# EAGLE design LinkMeterHM (EAGLE 5.10)
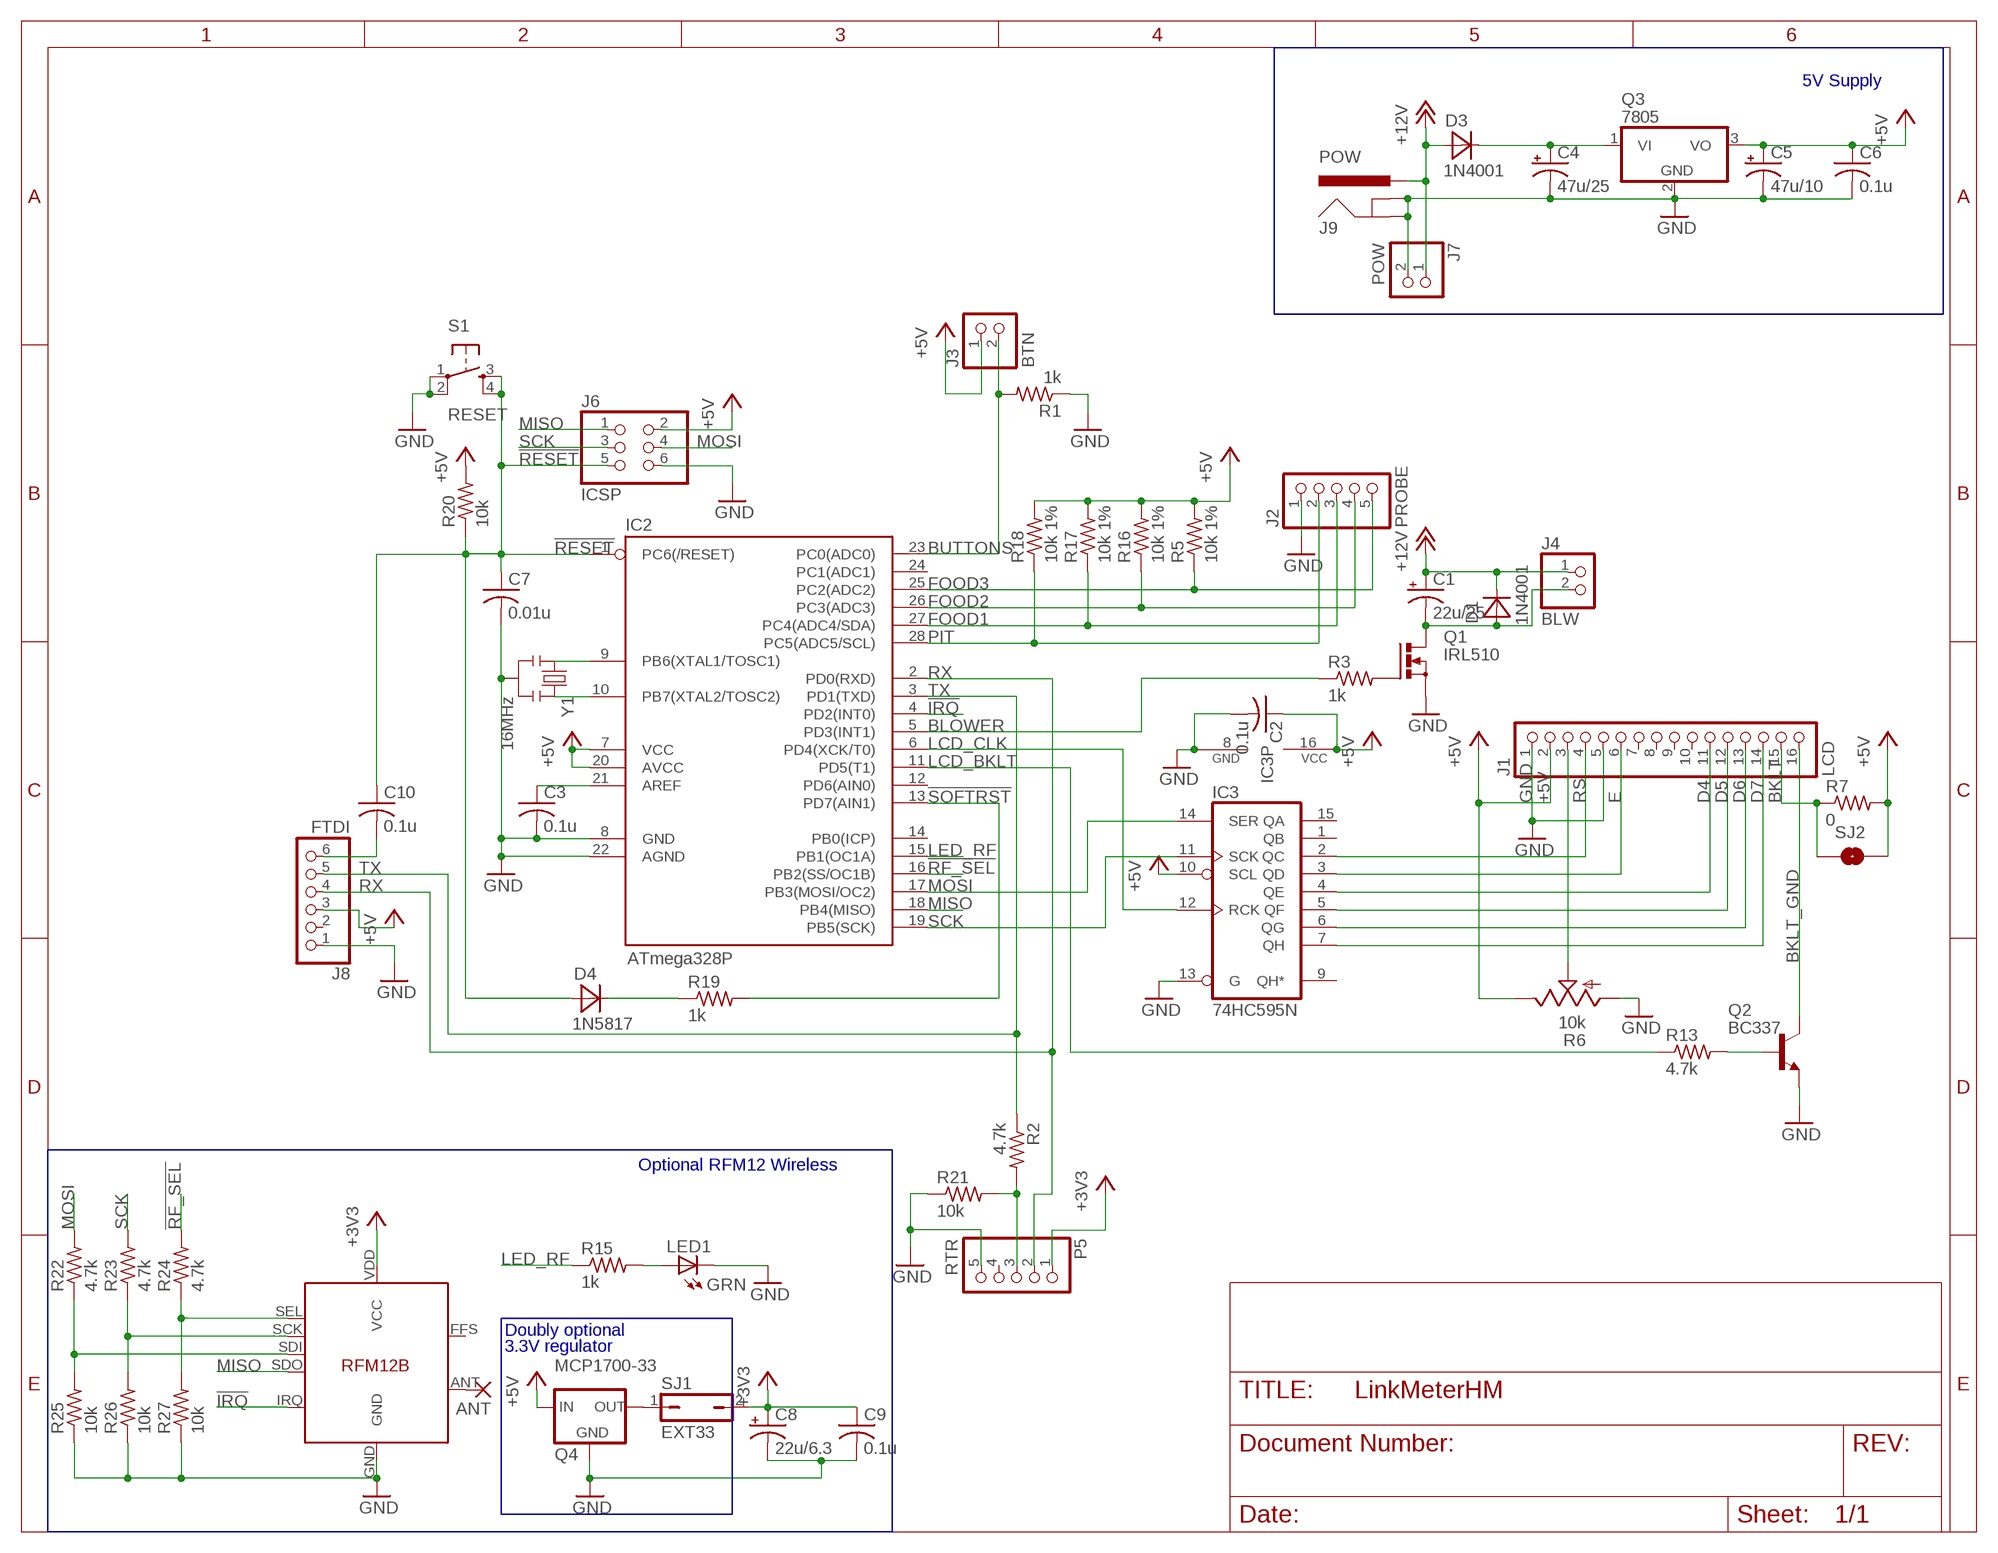
[diagram p0: schematic, sheet 1]

## Parts
ANT  1,6/0,8  [1,6/0,8]
C1  22u/25  CPOL-USE2.5-6  [E2,5-6]
C2  0.1u  C-US025-025X050  [C025-025X050]
C3  0.1u  C-US025-025X050  [C025-025X050]
C4  47u/25  CPOL-USE2.5-6  [E2,5-6]
C5  47u/10  CPOL-USE2.5-6  [E2,5-6]
C6  0.1u  C-US025-025X050  [C025-025X050]
C7  0.01u  C-US025-025X050  [C025-025X050]
C8  22u/6.3  CPOL-USE2.5-6  [E2,5-6]
C9  0.1u  C-US025-025X050  [C025-025X050]
C10  0.1u  C-US025-025X050  [C025-025X050]
D1  1N4001  DIODE-DO41-5  [DO41-5]
D3  1N4001  DIODE-DO41-7  [DO41-7]
D4  1N5817  DIODE-DO41-7  [DO41-7]
IC2  ATmega328P  AVR-MEGA8-PPTH  [DIL28-3]
IC3  74HC595N  74LS595N  [DIL16]
J1  LCD  PINHD-1X16  [1X16]
J2  PROBE  PINHD-1X5  [1X05]
J3  BTN  PINHD-1X2  [1X02]
J4  BLW  PINHD-1X2  [1X02]
J6  ICSP  PINHD-2X3  [2X03]
J7  POW  PINHD-1X2/90  [1X02/90]
J8  FTDI  PINHD-1X6  [1X06]
J9  POW  POWER_JACKPTH  [POWER_JACK_PTH]
LED1  GRN  LED3MM  [LED3MM]
P5  RTR  PINHD-1X5/90  [1X05/90]
Q1  IRL510  PMOSFET_NTO220BV  [TO220BV]
Q2  BC337  [TO92]
Q3  7805  7805TV  [TO220V]
Q4  MCP1700-33  MCP1700TRI  [TO92]
R1  1k  R-US_0204/7  [0204/7]
R2  4.7k  R-US_0204/7  [0204/7]
R3  1k  R-US_0204/7  [0204/7]
R5  10k 1%  R-US_0204/7  [0204/7]
R6  10k  TRIM_US-CT6  [CT6]
R7  0  R-US_0204/7  [0204/7]
R13  4.7k  R-US_0204/7  [0204/7]
R15  1k  R-US_0204/7  [0204/7]
R16  10k 1%  R-US_0204/7  [0204/7]
R17  10k 1%  R-US_0204/7  [0204/7]
R18  10k 1%  R-US_0204/7  [0204/7]
R19  1k  R-US_0204/7  [0204/7]
R20  10k  R-US_0204/7  [0204/7]
R21  10k  R-US_0204/7  [0204/7]
R22  4.7k  R-US_0204/7  [0204/7]
R23  4.7k  R-US_0204/7  [0204/7]
R24  4.7k  R-US_0204/7  [0204/7]
R25  10k  R-US_0204/7  [0204/7]
R26  10k  R-US_0204/7  [0204/7]
R27  10k  R-US_0204/7  [0204/7]
S1  RESET  TAC_SWITCHPTH  [TACTILE-PTH]
SJ1  EXT33  JP1QJP1  [JP1]
SJ2  CLIM  SOLDERJUMPERTRACE  [SJ_2S-TRACE]
U$1  RFM12B  [RFM12B]
Y1  16MHz  RESONATORRESONATOR-PTH  [RESONATOR-PTH]

## Nets
!IRQ: IC2.4(PD2(INT0)) U$1.IRQ
!RESET: C7.1 C10.1 D4.A IC2.1(PC6(/RESET)) J6.5 R20.1 S1.3 S1.4
!RF_SEL: IC2.16(PB2(SS/OC1B)) R24.2
!SOFTRST: IC2.13(PD7(AIN1)) R19.2
+3V3: C8.+ C9.1 P5.1 SJ1.2 U$1.VDD(VCC)
+5V: C2.1 C5.+ C6.1 IC2.7(VCC) IC2.20(AVCC) IC3.10(SCL) IC3.16(VCC) J1.2 J3.1 J6.2 J8.3 Q3.3(VO) Q4.2(IN) R5.2 R6.E R7.2 R16.2 R17.2 R18.2 R20.2 SJ2.2
+12V: C1.+ D1.C D3.A J4.1 J7.1 J9.PWR
BKLT: J1.15 R7.1 SJ2.1
BKLT_GND: J1.16 Q2.3(C)
BLOWER: IC2.5(PD3(INT1)) R3.1
BLW_GND: C1.- D1.A J4.2 Q1.D
BUTTONS: IC2.23(PC0(ADC0)) J3.2 R1.2
D4: IC3.4(QE) J1.11
D5: IC3.5(QF) J1.12
D6: IC3.6(QG) J1.13
D7: IC3.7(QH) J1.14
E: IC3.3(QD) J1.6
FOOD1: IC2.27(PC4(ADC4/SDA)) J2.3 R17.1
FOOD2: IC2.26(PC3(ADC3)) J2.4 R16.1
FOOD3: IC2.25(PC2(ADC2)) J2.5 R5.1
GND: C2.2 C3.2 C4.- C5.- C6.2 C7.2 C8.- C9.2 IC2.8(GND) IC2.22(AGND) IC3.8(GND) IC3.13(G) J1.1 J1.5 J2.1 J6.6 J7.2 J8.1 J9.GND J9.GNDBREAK LED1.K(C) P5.5 Q1.S Q2.1(E) Q3.2(GND) Q4.1(GND) R1.1 R6.A R21.1 R25.1 R26.1 R27.1 S1.1 S1.2 U$1.GND Y1.2
LCD_BKLT: IC2.11(PD5(T1)) R13.1
LCD_CLK: IC2.6(PD4(XCK/T0)) IC3.12(RCK)
LED_RF: IC2.15(PB1(OC1A)) R15.1
MISO: IC2.18(PB4(MISO)) J6.1 U$1.SDO
MOSI: IC2.17(PB3(MOSI/OC2)) IC3.14(SER) J6.4 R22.2
N$1: D4.C R19.1
N$2: Q4.3(OUT) SJ1.1
N$3: J1.3 R6.S
N$4: C10.2 J8.6
N$5: ANT.1(P) U$1.ANT
N$11: Q1.G R3.2
N$13: IC2.10(PB7(XTAL2/TOSC2)) Y1.3
N$16: IC2.9(PB6(XTAL1/TOSC1)) Y1.1
N$17: C3.1 IC2.21(AREF)
N$22: Q2.2(B) R13.2
N$24: LED1.A R15.2
N$26: P5.3 R2.2 R21.2
N$36: R24.1 R27.2 U$1.SEL
N$37: R23.1 R26.2 U$1.SCK
N$38: R22.1 R25.2 U$1.SDI
PIT: IC2.28(PC5(ADC5/SCL)) J2.2 R18.1
RS: IC3.2(QC) J1.4
RX: IC2.2(PD0(RXD)) J8.4 P5.2
SCK: IC2.19(PB5(SCK)) IC3.11(SCK) J6.3 R23.2
TX: IC2.3(PD1(TXD)) J8.5 R2.1
VRM_IN: C4.+ D3.C Q3.1(VI)
Unconnected: IC2.12(PD6(AIN0)) IC2.14(PB0(ICP)) IC2.24(PC1(ADC1)) IC3.1(QB) IC3.9(QH*) IC3.15(QA) J1.7 J1.8 J1.9 J1.10 J8.2 P5.4 U$1.FFS

## Buses
B$1
B$2
B$6

## Notes on the sheet
- 5V Supply
- Optional RFM12 Wireless
- Doubly optional
- 3.3V regulator

## Library data of the parts
ANT = JeeLabs:1,6/0,8: THROUGH-HOLE PAD
C1 C4 C5 C8 = resistor:CPOL-US: POLARIZED CAPACITOR, American symbol
C2 C3 C6 C7 C9 C10 = resistor:C-US: CAPACITOR, American symbol
D1 D3 D4 = Bryan:DIODE-: DO41 diodes with octagon holes and no diode symbol in silk
IC2 = SparkFun:AVR-MEGA8-P: MICROCONTROLLER 8 Kbytes FLASH 1 kbytes SRAM 512 bytes EEPROM USART 4-channel 10 bit ADC 2-channel 8 bit ADC
IC3 = 74xx-us:74*595: 8-bit SHIFT REGISTER, output latch
J1 = pinhead:PINHD-1X16: PIN HEADER
J2 P5 = pinhead:PINHD-1X5: PIN HEADER
J3 J4 J7 = pinhead:PINHD-1X2: PIN HEADER
J6 = pinhead:PINHD-2X3: PIN HEADER
J8 = pinhead:PINHD-1X6: PIN HEADER
J9 = SparkFun:POWER_JACK: Power Jack This is the standard 5.5mm barrel jack for power. The PTH is the most common, proven, reliable, footprint. All others are experimental. The Slot footprint only works if the mill layer is transmitted to the PCB fab house so be warned. Spark Fun Electronics SKU : PRT-00119. Mating wall wart : TOL-00298 (and others)
LED1 = led:LED: LED OSRAM: - CHIPLED LG R971, LG N971, LY N971, LG Q971, LY Q971, LO R971, LY R971 LH N974, LH R974 LS Q976, LO Q976, LY Q976 LO Q996 - Hyper CHIPLED LW Q18S LB Q993, LB Q99A, LB R99A - SideLED LS A670, LO A670, LY A670, LG A670, LP A670 LB A673, LV A673, LT A673, LW A673 LH A674 LY A675 LS A676, LA A676, LO A676, LY A676, LW A676 LS A679, LY A679, LG A679 - Hyper Micro SIDELED® LS Y876, LA Y876, LO Y876, LY Y876 LT Y87S - SmartLED LW L88C, LW L88S LB L89C, LB L89S, LG L890 LS L89K, LO L89K, LY L89K LS L896, LA L896, LO L896, LY L896 - TOPLED LS T670, LO T670, LY T670, LG T670, LP T670 LSG T670, LSP T670, LSY T670, LOP T670, LYG T670 LG T671, LOG T671, LSG T671 LB T673, LV T673, LT T673, LW T673 LH T674 LS T676, LA T676, LO T676, LY T676, LB T676, LH T676, LSB T676, LW T676 LB T67C, LV T67C, LT T67C, LS T67K, LO T67K, LY T67K, LW E67C LS E67B, LA E67B, LO E67B, LY E67B, LB E67C, LV E67C, LT E67C LW T67C LS T679, LY T679, LG T679 LS T770, LO T770, LY T770, LG T770, LP T770 LB T773, LV T773, LT T773, LW T773 LH T774 LS E675, LA E675, LY E675, LS T675 LS T776, LA T776, LO T776, LY T776, LB T776 LHGB T686 LT T68C, LB T68C - Hyper Mini TOPLED® LB M676 - Mini TOPLED Santana® LG M470 LS M47K, LO M47K, LY M47K Source: http://www.osram.convergy.de LUXEON: - LUMILED® LXK2-PW12-R00, LXK2-PW12-S00, LXK2-PW14-U00, LXK2-PW14-V00 LXK2-PM12-R00, LXK2-PM12-S00, LXK2-PM14-U00 LXK2-PE12-Q00, LXK2-PE12-R00, LXK2-PE12-S00, LXK2-PE14-T00, LXK2-PE14-U00 LXK2-PB12-K00, LXK2-PB12-L00, LXK2-PB12-M00, LXK2-PB14-N00, LXK2-PB14-P00, LXK2-PB14-Q00 LXK2-PR12-L00, LXK2-PR12-M00, LXK2-PR14-Q00, LXK2-PR14-R00 LXK2-PD12-Q00, LXK2-PD12-R00, LXK2-PD12-S00 LXK2-PH12-R00, LXK2-PH12-S00 LXK2-PL12-P00, LXK2-PL12-Q00, LXK2-PL12-R00 Source: www.luxeon.com KINGBRIGHT: KA-3528ASYC Source: www.kingbright.com
Q1 = transistor-power:PMOSFET_N: Power MOSFET N-Channel
Q2 = transistor:BC337: NPN TRANSISTOR
Q3 = linear:78*: Positive VOLTAGE REGULATOR Source: http://cache.national.com/ds/LM/LM78L05.pdf http://www.fairchildsemi.com/ds/LM/LM7805.pdf
Q4 = adafruit:MCP1700: VOLTAGE REGULATOR
R1-R3 R5 R7 R13 R15-R27 = resistor:R-US_: RESISTOR, American symbol
R6 = pot:TRIM_US-: POTENTIOMETER
S1 = SparkFun:TAC_SWITCH: Momentary Switch Button commonly used for reset or general input. Spark Fun Electronics SKU : COM-00097
SJ1 = Bryan:JP1Q
SJ2 = SparkFun:SOLDERJUMPER: Solder Jumper Standard SMD solder jumper. Used to automate production. Two varients : Normally Open and Normally Closed are the same, but have different paste layers. NC will have a large amount of paste and should jumper during reflow.
U$1 = JeeLabs:RFM12B
Y1 = Bryan:RESONATOR

## Board
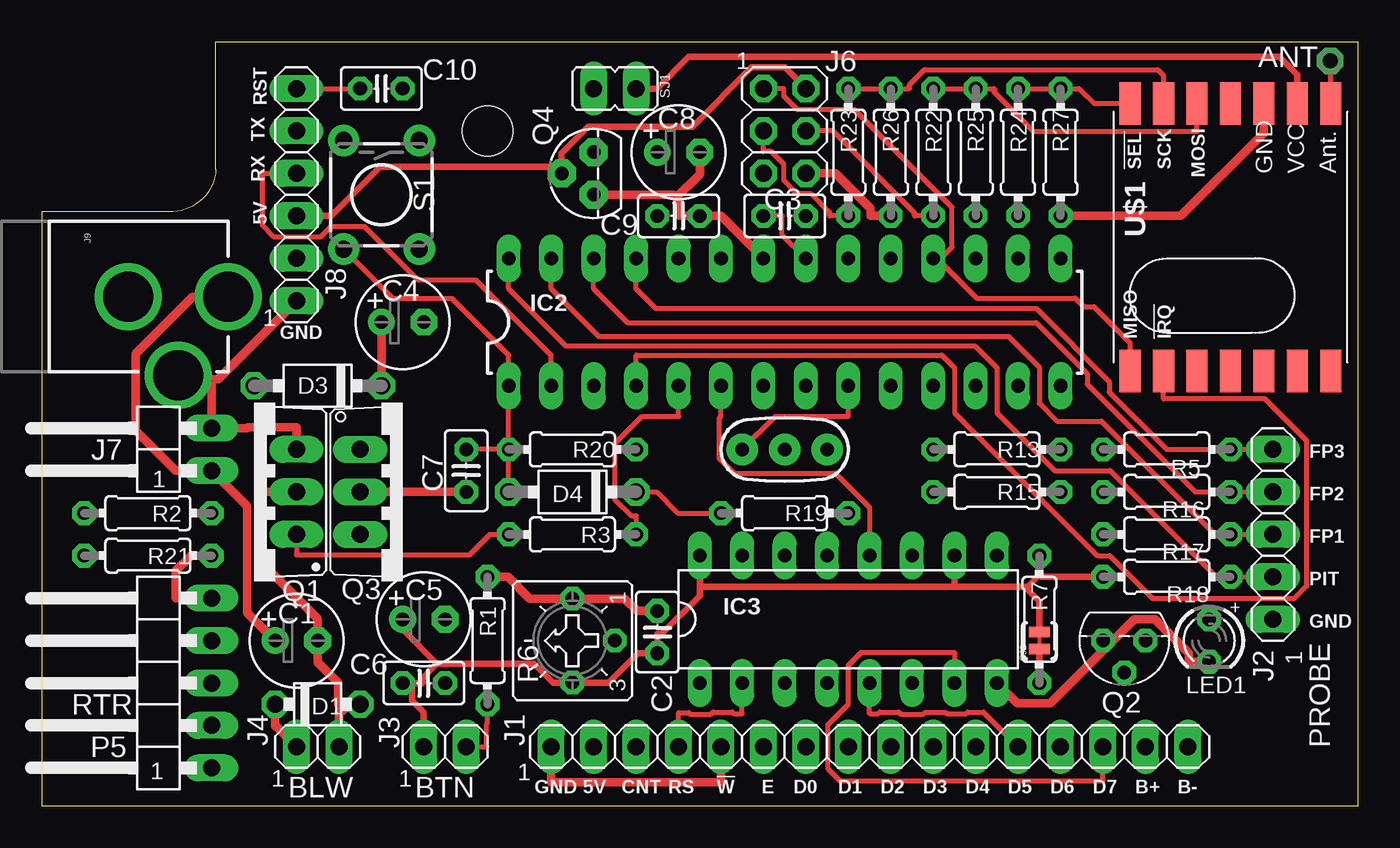
[diagram p1: board, top side]
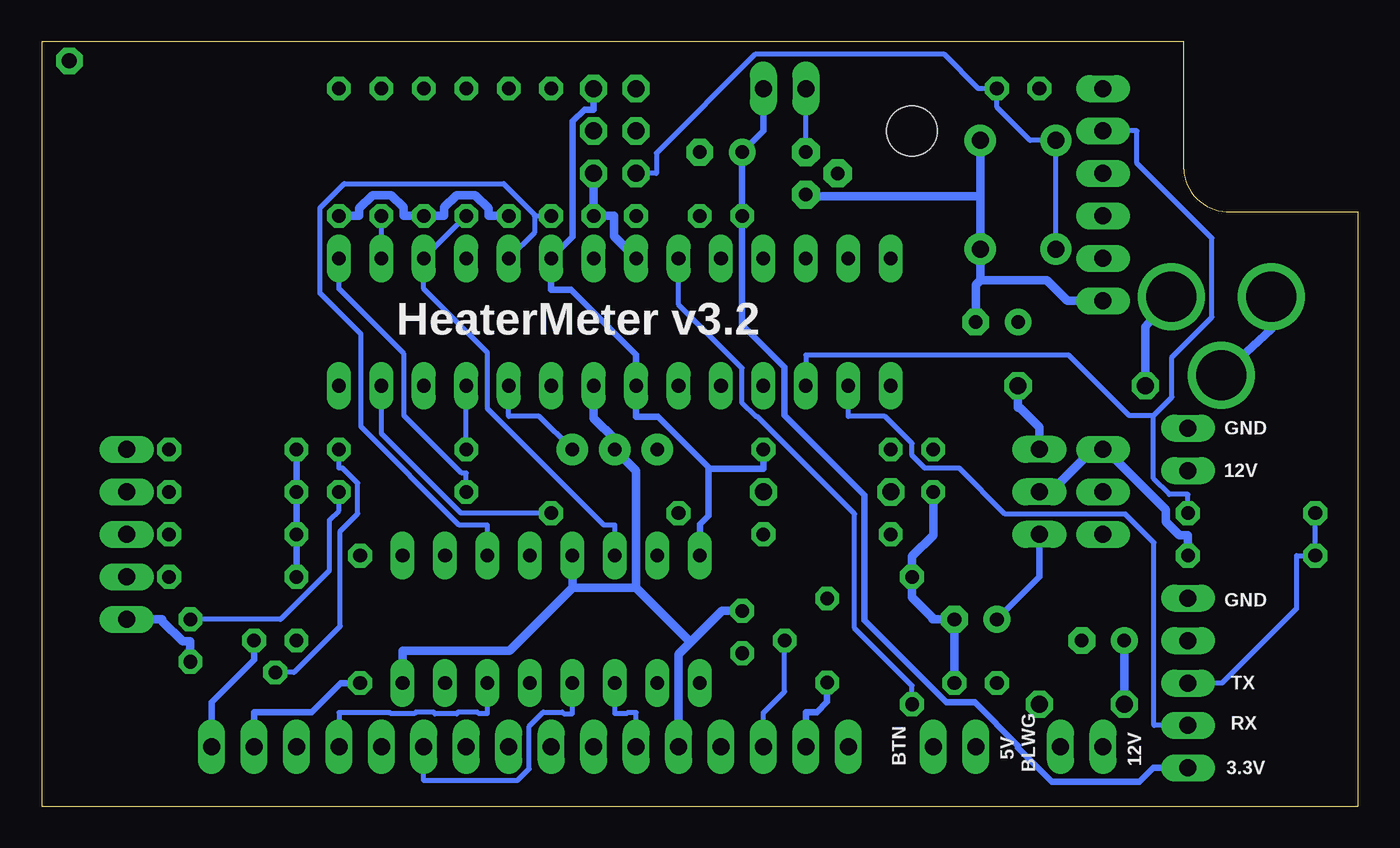
[diagram p2: board, bottom side, seen from below]

Size 78.74 x 45.72 mm. Coordinates in mm from the lower left corner, seen from the top.
Outline: 10.41,38.1 arc-90 7.62,35.56 0,35.56 0,0 78.74,0 78.74,45.72 10.41,45.72 10.41,38.1
Copper layers (1*16): Top 0.035mm / dielectric 1.5mm / Bottom 0.035mm
Design rules "default *": minimum track width 12mil, minimum drill 24mil, track to track 10mil, track to pad 10mil, pad to pad 10mil, via to via 10mil, smd to smd 8mil, copper to edge 15mil, drill to drill 20mil, minimum pad ring 12mil, minimum via ring 8mil, stop-mask expansion 4mil, vias tented up to drill 24mil, thermal gap 10mil
Holes 3 mm at 26.67,40.39

### Footprints (pad centres in the part's own frame; a part is rotated, then mirrored left to right if it is on the bottom)
1,6/0,8 = drill 0.9 pad 1.6 octagon: 1 0,0
E2,5-6 = drill 0.813 pad 1.6 round: + -1.27,0 | drill 0.813 pad 1.6 octagon: - 1.27,0
C025-025X050 = drill 0.813 octagon: 1 -1.27,0; 2 1.27,0
DO41-5 = drill 1.016 octagon: A 2.54,0; C -2.54,0
DO41-7 = drill 1.016 octagon: A 3.81,0; C -3.81,0
DIL28-3 = drill 0.813 long: 1 -16.51,-3.81; 2 -13.97,-3.81; 3 -11.43,-3.81; 4 -8.89,-3.81; 5 -6.35,-3.81; 6 -3.81,-3.81; 7 -1.27,-3.81; 8 1.27,-3.81; 9 3.81,-3.81; 10 6.35,-3.81; 11 8.89,-3.81; 12 11.43,-3.81; 13 13.97,-3.81; 14 16.51,-3.81; 15 16.51,3.81; 16 13.97,3.81; 17 11.43,3.81; 18 8.89,3.81; 19 6.35,3.81; 20 3.81,3.81; 21 1.27,3.81; 22 -1.27,3.81; 23 -3.81,3.81; 24 -6.35,3.81; 25 -8.89,3.81; 26 -11.43,3.81; 27 -13.97,3.81; 28 -16.51,3.81
DIL16 = drill 0.813 long: 1 -8.89,-3.81; 2 -6.35,-3.81; 3 -3.81,-3.81; 4 -1.27,-3.81; 5 1.27,-3.81; 6 3.81,-3.81; 7 6.35,-3.81; 8 8.89,-3.81; 9 8.89,3.81; 10 6.35,3.81; 11 3.81,3.81; 12 1.27,3.81; 13 -1.27,3.81; 14 -3.81,3.81; 15 -6.35,3.81; 16 -8.89,3.81
1X16 = drill 1.016 long: 1 -19.05,0; 2 -16.51,0; 3 -13.97,0; 4 -11.43,0; 5 -8.89,0; 6 -6.35,0; 7 -3.81,0; 8 -1.27,0; 9 1.27,0; 10 3.81,0; 11 6.35,0; 12 8.89,0; 13 11.43,0; 14 13.97,0; 15 16.51,0; 16 19.05,0
1X05 = drill 1.016 long: 1 -5.08,0; 2 -2.54,0; 3 0,0; 4 2.54,0; 5 5.08,0
1X02 = drill 1.016 long: 1 -1.27,0; 2 1.27,0
2X03 = drill 1.016 octagon: 1 -2.54,-1.27; 2 -2.54,1.27; 3 0,-1.27; 4 0,1.27; 5 2.54,-1.27; 6 2.54,1.27
1X02/90 = drill 1.016 long: 1 -1.27,-3.81; 2 1.27,-3.81
1X06 = drill 1.016 long: 1 -6.35,0; 2 -3.81,0; 3 -1.27,0; 4 1.27,0; 5 3.81,0; 6 6.35,0
POWER_JACK_PTH = drill 2.997 round: GND 0,7.7; GNDBREAK 4.7,10.7; PWR 0,13.7
LED3MM = drill 0.813 octagon: A -1.27,0; K 1.27,0
1X05/90 = drill 1.016 long: 1 -5.08,-3.81; 2 -2.54,-3.81; 3 0,-3.81; 4 2.54,-3.81; 5 5.08,-3.81
TO220BV = drill 1.016 long: D 0,-2.54; G -2.54,-2.54; S 2.54,-2.54
TO92 = drill 0.813 octagon: 1 1.27,0; 2 0,1.905; 3 -1.27,0
TO220V = drill 1.016 long: 1 -2.54,-2.54; 2 0,-2.54; 3 2.54,-2.54
TO92' = drill 0.813 pad 1.676 octagon: 1 -1.27,0; 2 0,1.905; 3 1.27,0
0204/7 = drill 0.813 octagon: 1 -3.81,0; 2 3.81,0
CT6 = drill 0.813 octagon: A 2.515,0; E -2.515,0; S 0,-2.54
TACTILE-PTH = drill 1.016 pad 1.88 round: 1 -3.251,2.261; 2 3.251,2.261; 3 -3.251,-2.261; 4 3.251,-2.261
JP1 = drill 1.016 long: 1 0,-1.27; 2 0,1.27
SJ_2S-TRACE = smd 0.635 x 1.27: 1 -0.508,0; 2 0.508,0
RFM12B = smd 2.54 x 1.27: ANT 8,-6; FFS -8,2; GND 8,-2; IRQ -8,4; P$8 -8,0; P$9 -8,-2; P$10 -8,-4; P$12 -8,-6; P$16 8,0; SCK 8,4; SDI 8,2; SDO -8,6; SEL 8,6; VDD 8,-4
RESONATOR-PTH = drill 0.813 pad 1.88 round: 1 -2.54,0; 2 0,0; 3 2.54,0

### Placement (x,y rotation side)
ANT  77.09,44.58 0 top
C1  15.24,9.91 0 top
C2  36.83,10.41 90 top
C3  44.45,35.31 0 top
C4  21.59,28.96 0 top
C5  22.86,11.18 0 top
C6  22.86,7.37 0 top
C7  25.4,20.07 270 top
C8  38.1,39.12 0 top
C9  38.1,35.31 0 top
C10  20.32,42.93 180 top
D1  16.51,6.1 0 top
D3  16.51,25.15 180 top
D4  31.75,18.8 180 top
IC2  44.45,28.96 0 top
IC3  48.26,11.18 0 top
J1  49.53,3.56 0 top
J2  73.66,16.26 90 top
J3  24.13,3.56 0 top
J4  16.51,3.56 0 top
J6  44.45,40.39 270 top
J7  6.35,21.34 90 top
J8  15.24,36.58 90 top
J9  -2.54,30.48 270 top
LED1  69.85,9.91 270 top
P5  6.35,7.37 90 top
Q1  12.7,18.8 90 top
Q2  64.77,9.91 180 top
Q3  21.59,18.8 270 top
Q4  MCP1700-33  [TO92']  33.02,37.85 90 top
R1  26.67,9.91 270 top
R2  6.35,17.53 180 top
R3  31.75,16.26 180 top
R5  67.31,21.34 180 top
R6  31.75,9.91 90 top
R7  59.69,11.18 90 top
R13  57.15,21.34 0 top
R15  57.15,18.8 0 top
R16  67.31,18.8 180 top
R17  67.31,16.26 180 top
R18  67.31,13.72 180 top
R19  44.45,17.53 0 top
R20  31.75,21.34 0 top
R21  6.35,14.99 180 top
R22  53.34,39.12 270 top
R23  48.26,39.12 270 top
R24  58.42,39.12 270 top
R25  55.88,39.12 90 top
R26  50.8,39.12 90 top
R27  60.96,39.12 90 top
S1  20.32,36.58 270 top
SJ1  34.29,42.93 270 top
SJ2  59.69,9.91 90 top
U$1  71.12,34.04 90 top
Y1  44.45,21.34 0 top

### Tracks (layer width: path | path; a pad name or v marks a point on that pad's centre or on a via)
!IRQ
  Top 0.305: IC2.4 35.56,26.98 53.86,26.98 54.61,26.22 54.61,23.53 63.16,14.99 63.91,14.99 66.45,12.45 74.98,12.45 75.7,13.17 75.7,21.84 73.18,24.36 67.12,24.36 U$1.IRQ
!RESET
  Top 0.305: S1.4 21.03,30.35 24.56,30.35 27.94,26.98 IC2.1 R20.1 | D4.A R20.1 | R20.1 C7.1
  Bottom 0.305: S1.4 S1.3 19.61,39.83 21.59,41.81 C10.1 22.71,42.93 24.74,44.96 36.06,44.96 41.96,39.06 41.96,37.85 J6.5
!RF_SEL
  Bottom 0.305: IC2.16 R24.2
!SOFTRST
  Bottom 0.305: R19.2 53.66,17.53 58.42,22.29 IC2.13
+3V3
  Top 0.381: SJ1.2 36.82,42.93 38.71,44.82 74.05,44.82 75.12,43.75 U$1.VDD
  Bottom 0.381: SJ1.2 35.56,40.39 C8.+ 36.83,36.46 C9.1 36.83,28.8 34.29,26.26 34.29,23.37 29.51,18.59 29.51,11.11 24.61,6.21 22.91,6.21 20.32,3.62 20.32,3.49 18.29,1.45 13.06,1.45 12.23,2.29 P5.1
+5V
  Top 0.381: R18.2 59.8,13.72 59.69,13.83 | 58.91,13.05 58.84,13.12 54.61,13.12 | SJ2.2 59.69,12.27 58.91,13.05 | 58.91,13.05 59.69,13.83 | 59.69,13.83 R7.2 | J6.2 44.46,44.18 42.47,44.18 38.92,40.63 32.69,40.63 31.11,39.06 31.11,38.25 | 39.37,13.12 39.37,12.59 37.08,10.3 36.83,10.3 C2.1 35.67,9.14 33.92,7.39 R6.E 30.59,7.39 29.46,8.53 23.64,8.53 | 39.37,13.12 54.61,13.12 | 39.37,13.12 IC3.16 | J8.3 17.31,35.31 20.26,38.25 31.11,38.25 | 31.11,38.25 Q4.2 | 54.61,13.12 IC3.10 | 23.64,8.53 22.75,7.64 22.75,7.37 22.17,7.37 | 23.64,8.53 21.59,10.57 C5.+ | J3.1 22.86,5.63 22.17,6.32 22.17,7.37 | 22.17,7.37 C6.1
  Bottom 0.381: 38.85,20.18 38.85,20.27 41.85,23.28 43.18,23.28 IC2.7 43.18,27.01 47.07,30.9 48.26,30.9 IC2.20 46.98,34.05 46.98,40.96 46.27,41.67 45.72,41.67 J6.2 | 38.85,20.18 38.85,17.37 39.37,16.85 IC3.16 | 38.85,20.18 35.56,20.18 R20.2 | Q3.3 19.05,13.72 C5.+ | J1.2 33.02,5.63 32.36,5.63 31.75,6.24 R6.E | R5.2 R16.2 R17.2 R18.2
+12V
  Top 0.508: D1.C 13.97,4.78 14.02,4.78 J4.1 | J9.PWR 9.03,30.48 5.63,27.07 5.63,22.46 8.03,20.07 J7.1 12.29,17.93 12.29,11.58 C1.+
  Bottom 0.508: D1.C C1.+ | J9.PWR 12.7,28.69 D3.A
BKLT
  Top 0.381: SJ2.1 R7.1
  Bottom 0.381: R7.1 60.85,7.37 62.59,5.63 66.04,5.63 J1.15
BKLT_GND
  Bottom 0.381: Q2.3 66.04,8.75 68.58,6.21 J1.16
BLOWER
  Top 0.305: IC2.5 38.1,23.32 35.92,23.32 34.31,21.71 34.31,18.31 35.25,17.37 35.56,17.37 R3.1
BLW_GND
  Top 0.508: J4.2 17.78,5.69 17.98,5.69 18.39,6.1 | 18.39,6.1 17.73,6.1 17.73,7.38 16.51,8.6 C1.- 16.51,11.21 13.11,14.62 13.11,18.8 Q1.D | 18.39,6.1 D1.A
BUTTONS
  Top 0.305: J3.2 26.62,3.56 26.62,4.93 26.67,4.98 R1.2
  Bottom 0.305: R1.2 26.67,7.21 30.11,10.65 30.11,17.48 35.95,23.32 36.03,23.32 36.83,24.11 36.83,26.19 40.64,30 IC2.23
D4
  Bottom 0.305: IC3.4 46.99,5.54 47.51,5.54 47.59,5.62 48.74,5.62 49.58,4.78 49.58,2.23 50.29,1.52 55.88,1.52 J1.11
D5
  Top 0.305: IC3.5 49.53,5.54 50.05,5.54 50.13,5.62 51.28,5.62 51.4,5.5 52.75,5.5 52.86,5.61 54.07,5.61 54.15,5.53 55.32,5.53 55.41,5.63 56.35,5.63 J1.12
D6
  Bottom 0.305: IC3.6 52.07,5.54 52.59,5.54 52.67,5.62 53.82,5.62 53.91,5.53 55.21,5.53 55.3,5.62 56.36,5.62 56.44,5.53 57.86,5.53 57.91,5.59 60.96,5.59 J1.13
D7
  Top 0.305: IC3.7 54.61,9.2 49.03,9.2 48.26,8.42 48.26,6.09 47.04,4.87 47.04,2.24 47.76,1.52 63.5,1.52 J1.14
E
  Bottom 0.305: J1.6 43.18,5.59 43.69,5.59 43.74,5.54 44.45,5.54 IC3.3
FOOD1
  Top 0.305: IC2.27 30.48,30.94 33.32,28.09 57.85,28.09 59.69,26.25 59.69,24.09 60.74,23.04 63.41,23.04 70,16.44 70,16.26 R17.1 J2.3
FOOD2
  Top 0.305: IC2.26 33.02,30.94 35.04,28.92 59.5,28.92 62.56,25.86 62.56,25.25 69.01,18.8 R16.1 J2.4
FOOD3
  Top 0.305: IC2.25 35.56,30.94 36.73,29.77 59.5,29.77 63.87,25.4 63.87,24.77 67.3,21.34 R5.1 J2.5
GND
  Top 0.508: IC3.8 58.37,6.15 60.35,6.15 63.5,9.3 | LED1.K 68.63,8.64 68.63,9.14 66.59,11.18 65.38,11.18 63.5,9.3 | 63.5,9.3 Q2.1 | J1.1 30.48,1.42 40.64,1.42 J1.5 | 37.96,36.39 38.15,36.2 38.15,35.31 C9.2 40.64,35.31 IC2.22 | Q4.1 37.77,36.58 37.96,36.39 | 37.96,36.39 39.37,37.81 C8.- | R26.1 49.58,35.31 49.58,35.76 47.5,37.85 J6.6 | R21.1 8.94,14.99 8.03,14.07 8.03,12.45 P5.5 | 10.16,25.53 10.54,25.53 J8.1 | 10.16,25.53 J9.GNDBREAK | 10.16,25.53 10.16,23.93 J7.2 12.29,22.61 12.35,22.66 15.24,22.66 Q1.S | U$1.GND 73.12,40.26 68.17,35.31 R27.1 | Q3.2 C7.2 | C2.2 35.61,11.68 34.87,12.42 R6.A 29.18,12.42 27.89,13.72 R1.1
  Bottom 0.508: IC3.8 57.15,9.3 50.75,9.3 46.99,13.06 | 46.99,13.06 IC3.13 | 43.18,13.06 46.99,13.06 | 43.18,13.06 43.18,20.07 Y1.2 44.45,21.95 45.72,23.21 IC2.8 | 39.93,9.8 43.18,13.06 | R26.1 52.02,35.31 52.02,35.76 52.8,36.55 53.92,36.55 54.66,35.81 54.66,35.31 R25.1 57.1,35.31 57.1,35.81 57.84,36.55 58.96,36.55 59.74,35.76 59.74,35.31 R27.1 | 39.93,9.8 40.64,9.09 J1.5 | 39.93,9.8 38.05,11.68 C2.2 | 22.58,36.49 32.93,36.49 Q4.1 | 22.58,36.49 S1.2 22.58,31.46 | 22.58,36.49 S1.1 | J9.GNDBREAK 5.16,28.53 J9.GND | LED1.K 69.85,9.86 70.31,9.86 71.53,11.07 71.53,11.18 J2.1 | J6.6 C3.2 44.5,35.31 44.5,34.09 IC2.22 | C7.2 25.4,16.2 26.67,14.94 R1.1 26.67,12.5 25.44,11.27 25.44,11.18 C5.- C6.2 | 22.58,31.46 18.61,31.46 17.37,30.23 J8.1 | C4.- 22.86,31.18 22.58,31.46 | R21.1 10.16,16.2 10.66,16.2 11.48,17.02 11.48,17.72 15.1,21.34 Q1.S 15.81,21.34 18.36,18.8 Q3.2
LCD_BKLT
  Bottom 0.305: R13.1 IC2.11
LCD_CLK
  Top 0.305: IC2.6 40.64,23.32 40.54,23.22 40.54,20.78 41.4,19.91 47.48,19.91 49.53,17.87 IC3.12
LED_RF
  Bottom 0.305: IC2.15 60.96,30.94 57.07,27.05 57.07,23.36 53.62,19.91 53.34,19.91 R15.1
MISO
  Top 0.305: 53.68,32.65 55.94,30.39 61.83,30.39 62.34,29.88 62.96,29.88 65.12,27.71 U$1.SDO | J6.1 44.4,42.93 44.4,42.47 45.21,41.66 48.64,41.66 54.47,35.83 54.47,33.43 53.68,32.65 | 53.68,32.65 | 53.68,32.65 53.46,32.65 IC2.18
MOSI
  Top 0.305: R22.2 52.22,35.31 52.22,35.49 47.33,40.39 J6.4
  Bottom 0.305: IC3.14 44.45,16.82 45.11,16.82 52.07,23.77 52.07,27.13 55.88,30.94 IC2.17 R22.2
N$1
  Top 0.305: D4.C 36.78,18.8 38.05,17.53 R19.1
N$2
  Bottom 0.305: Q4.3 SJ1.1
N$3
  Bottom 0.305: J1.3 35.56,5.59 34.29,6.86 R6.S
N$4
  Top 0.305: J8.6 C10.2
N$5
  Top 0.305: U$1.ANT 77.12,43.71 77.09,43.94 ANT.1
N$11
  Top 0.305: Q1.G 15.24,15.04 25.6,15.04 26.82,16.26 R3.2
N$13
  Bottom 0.305: IC2.10 50.8,23.32 48.97,23.32 Y1.3
N$16
  Top 0.305: IC2.9 48.26,23.32 43.89,23.32 Y1.1
N$17
  Top 0.305: C3.1 44.3,35.31 44.3,34.19 IC2.21
N$22
  Bottom 0.305: R13.2 60.96,20.22 60.73,20.22 59.83,19.32 59.83,17.5 60.88,16.45 60.88,10.77 63.65,8 Q2.2
N$24
  Bottom 0.305: LED1.A 64.45,11.18 61.52,14.11 61.52,17.12 60.96,17.68 R15.2
N$26
  Bottom 0.305: P5.3 8.13,7.37 3.66,11.84 3.66,14.99 R21.2 R2.2
N$36
  Top 0.305: U$1.SEL 62.97,42.04 62.08,42.93 R27.2 R24.1
N$37
  Top 0.305: U$1.SCK 67.12,43.71 66.77,44.06 52.82,44.06 51.92,43.16 51.92,42.93 R26.2 R23.1
N$38
  Top 0.305: U$1.SDI 69.12,40.36 59.33,40.36 57,42.69 57,42.93 R25.2 R22.1
PIT
  Top 0.305: IC2.28 27.94,30.94 31.34,27.53 55.83,27.53 57.15,26.21 57.15,23.53 60.61,20.07 63.93,20.07 70,13.99 70,13.72 R18.1 J2.2
RS
  Top 0.305: IC3.2 41.91,5.54 41.39,5.54 41.31,5.62 40.16,5.62 40.04,5.5 38.79,5.5 38.7,5.59 38.1,5.59 J1.4
RX
  Top 0.305: J8.4 13.21,37.85 13.21,34.74 13.91,34.04 16.66,34.04 17.3,34.67 19.33,34.67 22.53,31.47 25.98,31.47 30.48,26.98 IC2.2
  Bottom 0.305: IC2.2 30.48,23.32 28.29,23.32 26.67,21.69 26.67,20.98 25.91,20.22 23.85,20.22 21.11,17.48 13.9,17.48 12.19,15.77 12.19,4.83 P5.2
SCK
  Top 0.305: R23.2 47.14,35.31 47.14,35.54 46.05,36.63 45.2,36.63 44.4,37.42 44.4,38.41 43.64,39.17 43.18,39.17 J6.3
  Bottom 0.305: 49.26,35.31 49.26,34.31 IC2.19 | 49.26,35.31 49.26,35.39 51.1,37.23 60.64,37.23 62.09,35.78 62.09,30.68 59.65,28.23 59.65,22.7 53.76,16.82 52.07,16.82 IC3.11 | 49.26,35.31 R23.2
TX
  Bottom 0.305: 12.23,23.36 11.11,24.47 11.11,26.86 8.73,29.25 8.73,33.97 13.21,38.45 13.21,40.39 J8.5 | 12.23,23.36 12.23,19.59 11.28,18.64 10.16,18.64 R2.1 | 12.23,23.36 13.68,23.36 17.3,26.98 33.02,26.98 IC2.3
VRM_IN
  Top 0.508: D3.C C4.+
  Bottom 0.508: D3.C 20.32,23.82 20.22,23.82 19.05,22.66 Q3.1

### Text on the board
tNames: 1 | 1 | 1 | 1 | 1 | 1 | 1 | 1
_tsilk: RST | TX | !SEL | SCK | MOSI | RX | 5V | GND | MISO | !IRQ | FP3 | FP2 | FP1 | PIT | + | GND | GND | 5V | CNT | RS | !W | E | D0 | D1 | D2 | D3 | D4 | D5 | D6 | D7 | B+ | B-
_bsilk: HeaterMeter v3.2 | GND | 12V | GND | TX | RX | 5V | 3.3V | 12V | BLWG | BTN